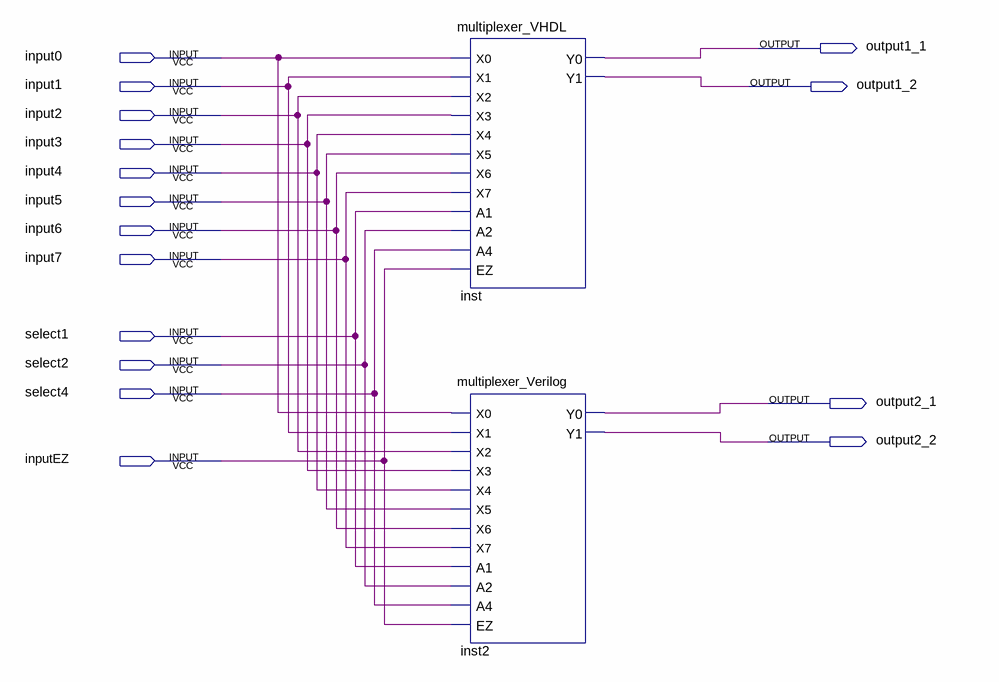
[diagram p0: schematic sheet]
// Quartus schematic lab5_multiplexer.bdf as structural Verilog: 2 symbols, 16 pins
module lab5_multiplexer (
  input  input0,
  input  input1,
  input  input2,
  input  input3,
  input  input4,
  input  input5,
  input  input6,
  input  input7,
  input  select1,
  input  select2,
  input  select4,
  input  inputEZ,
  output output1_1,
  output output1_2,
  output output2_1,
  output output2_2
);

  multiplexer_VHDL inst (
    .X0(input0), .X1(input1), .X2(input2), .X3(input3), .X4(input4), .X5(input5), .X6(input6), .X7(input7),
    .A1(select1), .A2(select2), .A4(select4), .EZ(inputEZ), .Y0(output1_1), .Y1(output1_2));
  multiplexer_Verilog inst2 (
    .X0(input0), .X1(input1), .X2(input2), .X3(input3), .X4(input4), .X5(input5), .X6(input6), .X7(input7),
    .A1(select1), .A2(select2), .A4(select4), .EZ(inputEZ), .Y0(output2_1), .Y1(output2_2));
endmodule
